# EAGLE schematic vacuum-cleaner (EAGLE 8.4.1)
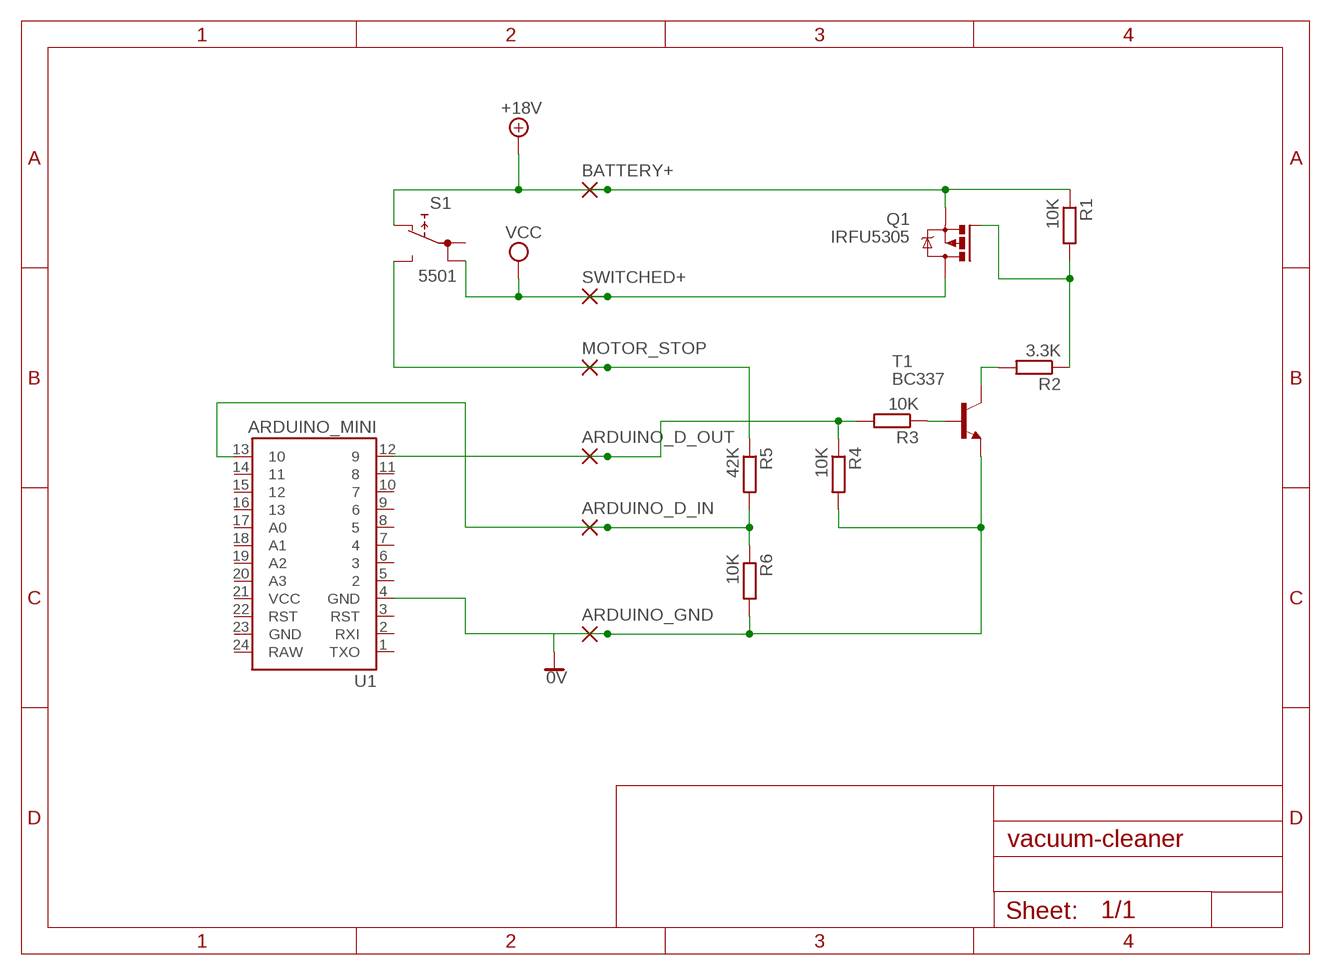
[diagram p0: schematic, sheet 1]

## Parts
ARDUINO_D_IN  2,54/0,8  [2,54/0,8]
ARDUINO_D_OUT  2,54/0,8  [2,54/0,8]
ARDUINO_GND  2,54/0,8  [2,54/0,8]
BATTERY+  2,54/0,8  [2,54/0,8]
MOTOR_STOP  2,54/0,8  [2,54/0,8]
Q1  IRFU5305  [I-PAK_TO251AA]
R1  10K  R-EU_0207/10  [0207/10]
R2  3.3K  R-EU_0207/10  [0207/10]
R3  10K  R-EU_0207/10  [0207/10]
R4  10K  R-EU_0207/10  [0207/10]
R5  42K  R-EU_0207/10  [0207/10]
R6  10K  R-EU_0207/10  [0207/10]
S1  5501  [5501]
SWITCHED+  2,54/0,8  [2,54/0,8]
T1  BC337  [TO92]
U1  ARDUINO_MINI  [ARDUINO_MINI]

## Nets
0V: ARDUINO_GND.1(P) R4.2 R6.2 T1.1(E) U1.4(GND)
+18V: BATTERY+.1(P) Q1.3(S) R1.1 S1.NC
N$1: R3.1 T1.2(B)
N$3: R2.2 T1.3(C)
N$4: ARDUINO_D_IN.1(P) R5.2 R6.1 U1.13
N$5: Q1.1(G) R1.2 R2.1
N$6: MOTOR_STOP.1(P) R5.1 S1.NO
N$7: ARDUINO_D_OUT.1(P) R3.2 R4.1 U1.12
VCC: Q1.2(D) S1.1B SWITCHED+.1(P)
Unconnected: S1.1A U1.1(TXO) U1.2(RXI) U1.3(RST) U1.5 U1.6 U1.7 U1.8 U1.9 U1.10 U1.11 U1.14 U1.15 U1.16 U1.17(A0) U1.18(A1) U1.19(A2) U1.20(A3) U1.21(VCC) U1.22(RST) U1.23(GND) U1.24(RAW)

## Library data of the parts
ARDUINO_D_IN ARDUINO_D_OUT ARDUINO_GND BATTERY+ MOTOR_STOP SWITCHED+ = wirepad:2,54/0,8: THROUGH-HOLE PAD
Q1 = transistor-power:IRF?5305: HEXFET Power MOSFET Source: http://www.irf.com/product-info/datasheets/data/irfr5305pbf.pdf
R1-R6 = rcl:R-EU_: RESISTOR, European symbol
S1 = switch:55?: PUSHBUTTON SERIES 5500 SWITCHES Source: www.e-switch.com .. 5500.pdf
T1 = transistor:BC337: NPN TRANSISTOR
U1 = SparkFun-Retired:ARDUINO_MINI: Arduino Pro Mini footprint